# Altium schematic sheet TESTEAMPOP.SchDoc
size A0; SheetNumber: 8; SheetTotal: 9
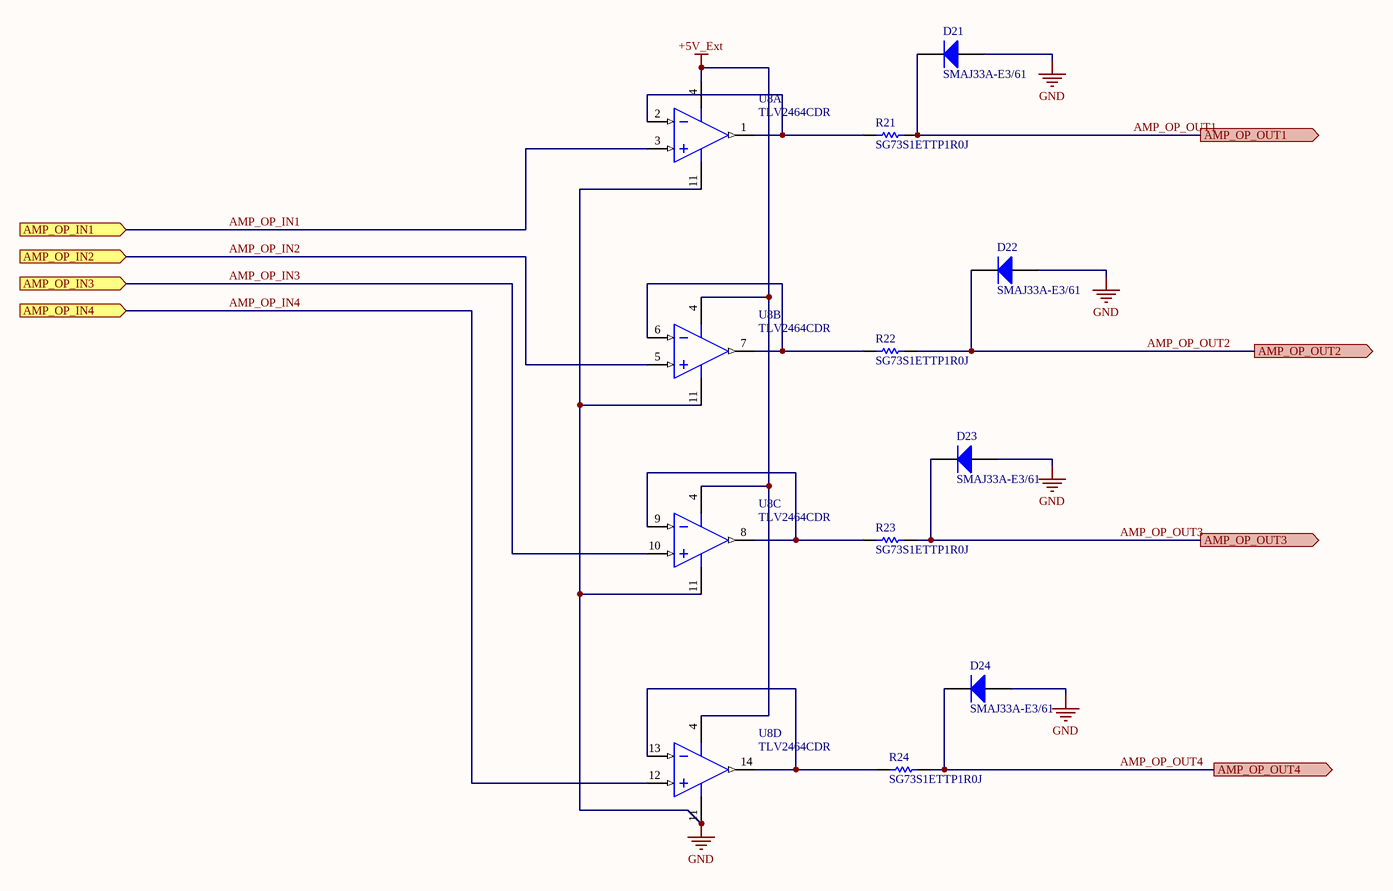
[diagram p0: TESTEAMPOP.SchDoc]

## Parts
D21  SMAJ33A-E3/61  [VISH-DO-214AC-2_L]
D22  SMAJ33A-E3/61  [VISH-DO-214AC-2_L]
D23  SMAJ33A-E3/61  [VISH-DO-214AC-2_L]
D24  SMAJ33A-E3/61  [VISH-DO-214AC-2_L]
R21  SG73S1ETTP1R0J  [RESC1005X40X25LL10T10]
R22  SG73S1ETTP1R0J  [RESC1005X40X25LL10T10]
R23  SG73S1ETTP1R0J  [RESC1005X40X25LL10T10]
R24  SG73S1ETTP1R0J  [RESC1005X40X25LL10T10]
U8  TLV2464CDR  [D0014A_N]  (parts A,B,C,D of 4)

## Ports
AMP_OP_IN1 (in), AMP_OP_IN2 (in), AMP_OP_IN3 (in), AMP_OP_IN4 (in), AMP_OP_OUT1 (out), AMP_OP_OUT2 (out), AMP_OP_OUT3 (out), AMP_OP_OUT4 (out)

## Nets
+5V_Ext: U8.4(VDD+)
GND: D21.2(A) D22.2(A) D23.2(A) D24.2(A) U8.11(GND)
AMP_OP_IN1: U8.3(IN1+) ; port AMP_OP_IN1
AMP_OP_IN2: U8.5(IN2+) ; port AMP_OP_IN2
AMP_OP_IN3: U8.10(IN3+) ; port AMP_OP_IN3
AMP_OP_IN4: U8.12(IN4+) ; port AMP_OP_IN4
AMP_OP_OUT1: D21.1(K) R21.2 ; port AMP_OP_OUT1
AMP_OP_OUT2: D22.1(K) R22.2 ; port AMP_OP_OUT2
AMP_OP_OUT3: D23.1(K) R23.2 ; port AMP_OP_OUT3
AMP_OP_OUT4: D24.1(K) R24.2 ; port AMP_OP_OUT4
NetR21_1: R21.1 U8.1(OUT1) U8.2(IN1-)
NetR22_1: R22.1 U8.6(IN2-) U8.7(OUT2)
NetR23_1: R23.1 U8.8(OUT3) U8.9(IN3-)
NetR24_1: R24.1 U8.13(IN4-) U8.14(OUT4)

## Library data of the parts
D21-D24 = CMP-0548-00255-2: Transient Voltage Suppressor, 6.40 to 231 V, 33 V Stand-off Voltage, Uni-Directional, -55 to 155 degC, 2-pin DO-214AC, Pb-Free, Tape and Reel; Manufacturer: Vishay Semiconductor; VBR Uni-Directional (V): 6.4 to 231; ID (uA): 1; IFSM: 40 A; VWM (V): 33; PPPM (W): 400, 300; ComponentLink2Description: Datasheet; RoHS: TRUE; Mounting Technology: Surface Mount; ComponentLink2URL: http://www.vishay.com/docs/88390/smaj50a.pdf; PackageDescription: 2-Pin DO-214AC (SMA), Body 4.245 x 2.665 mm; PartNumber: SMAJ33A-E3/61; DatasheetVersion: 12/8/2013; ComponentLink1URL: http://www.vishay.com/; ComponentLink3Description: Package Specification; PackageReference: DO-214AC-2; ComponentLink3URL: http://www.vishay.com/docs/88390/smaj50a.pdf; ComponentLink1Description: Manufacturer URL; Operating Junction and Storage Temperature Range: -55 to 150 degC; Packing: Tape and Reel
R21-R24 = CMP-2002-04124-1: Manufacturer: KOA Speer; Part Number: SG73S1ETTP1R0J
U8 = CMP-0271-00006-3: Quad Low Power, Rail-to-Rail Input / Output Operational Amplifier, 2.7 to 6 V, 0 to 70 degC, 14-pin SOIC (D14), Green (RoHS & no Sb/Br); Manufacturer: Texas Instruments; Offset Drift(Typ)(uV/C): 2; Total Supply Voltage(Min)(+5V is 5, +/-5V is 10): 2.7; IIB(Max)(pA): 14000; CMRR(Min)(dB): 66; Iq per channel(Max)(mA): 0.575; Vn at 1kHz(Typ)(nV/rtHz): 11; Slew Rate(Typ)(V/us): 1.6; Number of Channels: 4; Sub Family: High Output Current Amplifier (>=50mA), Low Supply Voltage Amplifier (<=2.7V), Precision Amplifier; Total Supply Voltage(Max)(+5V is 5, +/-5V is 10): 6; ComponentLink3URL: http://www.ti.com/lit/ml/mpds177g/mpds177g.pdf; ComponentLink1Description: Manufacturer URL; PackageReference: D0014A; Vio (25C)(Max)(mV): 2; Mounting Technology: Surface Mount; PackageDescription: 14-Pin Plastic Small Outline, Body 8.65 x 3.9 mm, Pitch 1.27 mm; ComponentLink2Description: Datasheet; ComponentLink3Description: Package Specification; ComponentLink1URL: http://www.ti.com/; DatasheetVersion: SLOS220J; PartNumber: TLV2464CDR; Code_JEDEC: MS-012; PackageVersion: 4040047-5/M, 06/2011; ComponentLink2URL: http://www.ti.com/general/docs/lit/getliterature.tsp?genericPartNumber=TLV2464&fileType=pdf; Eco-Plan: Green (RoHS & no Sb/Br)